# EAGLE design ds3231_breakout (EAGLE 9.3.1)
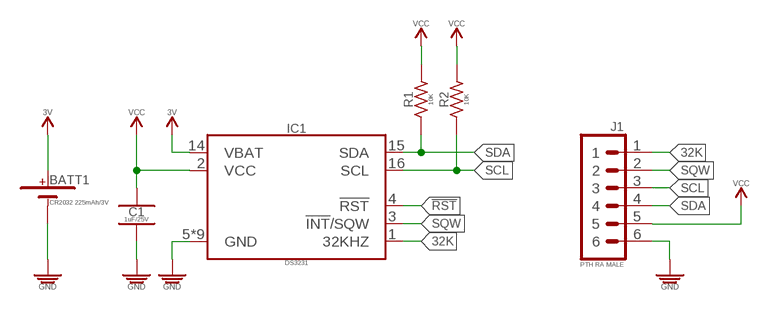
[diagram p0: schematic, sheet 1]

## Parts
BATT1  CR2032 225mAh/3V  BATTERY_COIN-CELL_PTH_3V_20MM  [BATTERY_COINCELL-20MM-PTH]
C1  1uF/25V  1UF_CER_SMD-0402_25V-10%  [CAPC1005X55_SMD-0402]
IC1  DS3231  DS3231_DS3231_RTC_CLK_I2C_SOIC-16  [SOIC127P1032X265-16]
J1  PTH RA MALE  1X06PTH_RA_MALE_2.54MM  [HDRRA6W64P254_1X6_1524X254X254B]
R1  10K  10KΩ_SMD-0402_1/16W-5%  [RESC1005X35_SMD-0402]
R2  10K  10KΩ_SMD-0402_1/16W-5%  [RESC1005X35_SMD-0402]

## Nets
3V: BATT1.+ IC1.14(VBAT)
32K: IC1.1(32KHZ) J1.1
!RST: IC1.4(!RST)
GND: BATT1.- C1.2 IC1.5(GND) IC1.6(GND) IC1.7(GND) IC1.8(GND) IC1.9(GND) IC1.10(GND) IC1.11(GND) IC1.12(GND) IC1.13(GND) J1.6
SCL: IC1.16(SCL) J1.3 R2.1
SDA: IC1.15(SDA) J1.4 R1.1
SQW: IC1.3(!INT!/SQW) J1.2
VCC: C1.1 IC1.2(VCC) J1.5 R1.2 R2.2

## Library data of the parts
BATT1 = _batteries:BATTERY_COIN-CELL; DATASHEET: https://media.digikey.com/pdf/Data%20Sheets/Panasonic%20Inustrial/CR_Series.pdf; DATASHEET_CONNECTOR: http://www.memoryprotectiondevices.com/datasheets/BS-7-datasheet.pdf; DIST: Digikey; DISTLINK: https://www.digikey.com/product-detail/en/panasonic-bsg/CR2032/P189-ND/31939; DISTLINK_CONNECTOR: https://www.digikey.com/product-detail/en/mpd-memory-protection-devices/BS-7/BS-7-ND/389447; DISTPN: P189-ND; DISTPN_CONNECTOR: BS-7-ND; DIST_CONNECTOR: Digikey; MFR: Panasonic - BSG; MFR_CONNECTOR: BS-7-ND; MPN: CR2032; MPN_CONNECTOR: BS-7
C1 = _capacitors:1UF; DATASHEET: https://product.tdk.com/info/en/catalog/datasheets/mlcc_commercial_lowprofile_en.pdf; DIST: Digikey; DISTLINK: https://www.digikey.com/products/en?keywords=445-13185-1-ND; DISTPN: 445-13185-1-ND; MFR: TDK Corporation; MPN: CGB2A1X5R1E105K033BC
IC1 = _special:DS3231; DATASHEET: https://datasheets.maximintegrated.com/en/ds/DS3231-DS3231S.pdf; DIST: Digikey; DISTLINK: https://www.digikey.com/products/en?keywords=DS3231S%23T%26RCT-ND; DISTPN: DS3231S#T&RCT-ND; MFR: Maxim Integrated; MPN: DS3231S#T&R
J1 = _connectors:1X06; DATASHEET: https://s3.amazonaws.com/catalogspreads-pdf/PAGE112-113%20.100%20MALE%20HDR.pdf; DIST: Digikey; DISTLINK: https://www.digikey.com/products/en?keywords=S1112E-06-ND; DISTPN: S1112E-06-ND; MFR: Sullins Connector Solutions; MPN: PEC06SBAN
R1 R2 = _resistors:10KΩ; DATASHEET: http://www.yageo.com/NewPortal/yageodocoutput?fileName=/pdf/R-Chip/PYu-RC_51_RoHS_P_0.pdf; DIST: Digikey; DISTLINK: https://www.digikey.com/products/en?keywords=YAG1281CT-ND; DISTPN: YAG1281CT-ND; MFR: Yageo; MPN: RC0402JR-0710KP

## Board
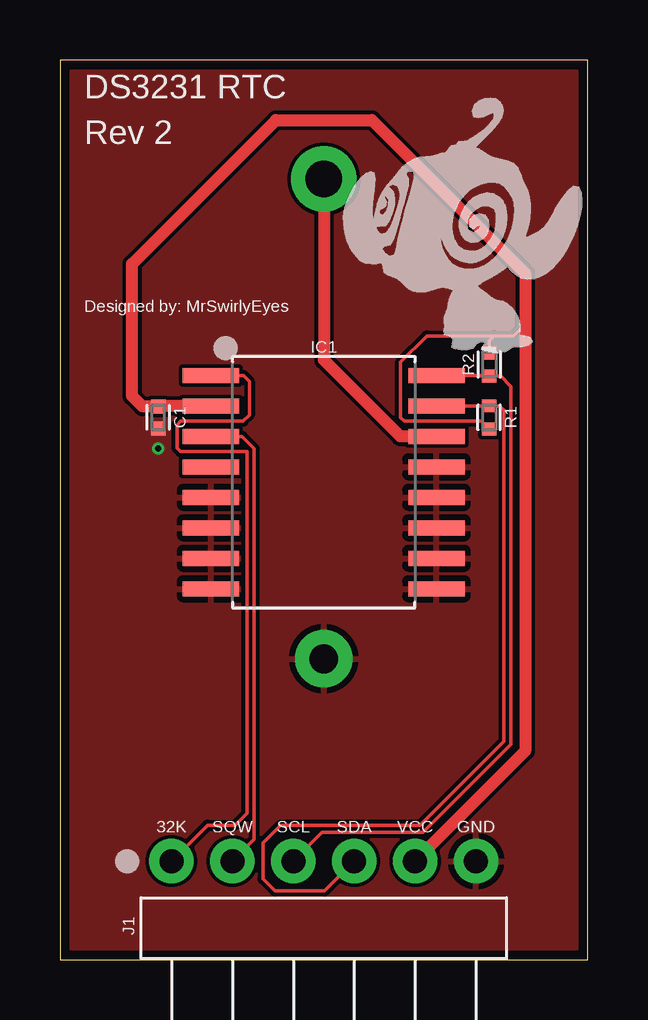
[diagram p1: board, top side]
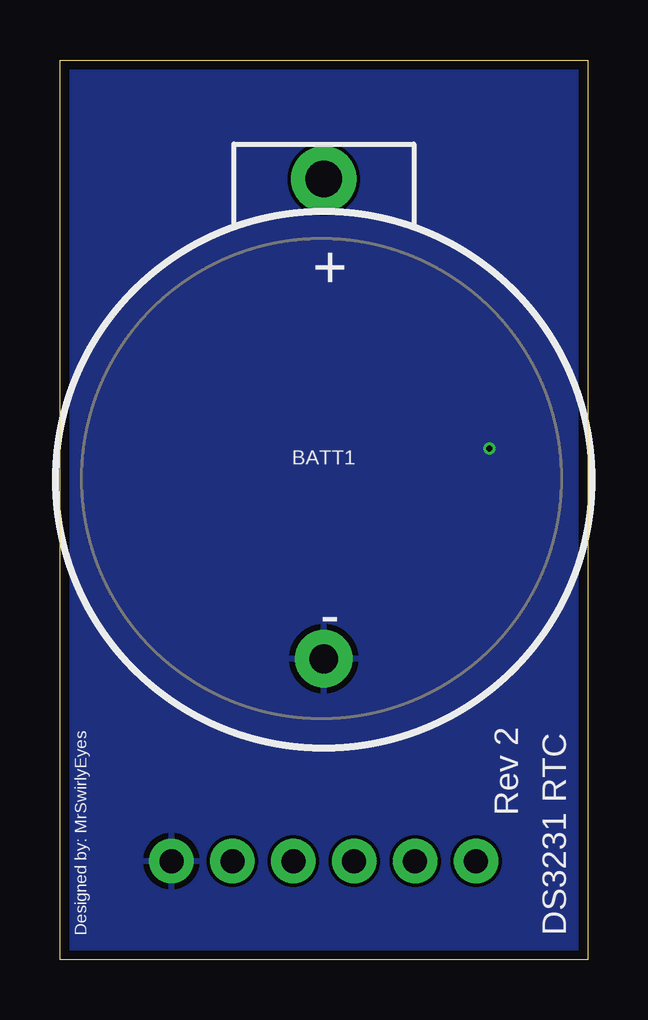
[diagram p2: board, bottom side, seen from below]

Size 22 x 37.5 mm. Coordinates in mm from the lower left corner, seen from the top.
Outline: 0,0 22,0 22,37.5 0,37.5 0,0
Copper layers (1*16): Top 0.035559375mm / dielectric 1.6mm / Bottom 0.035559375mm
Design rules "oshpark-2layer": minimum track width 6mil, minimum drill 10mil, track to track 6mil, track to pad 6mil, pad to pad 6mil, via to via 6mil, smd to smd 6mil, copper to edge 15mil, drill to drill 6mil, minimum pad ring 5mil, minimum via ring 5mil, stop-mask expansion 2.5mil, vias tented up to drill 0mil, thermal gap 10mil

### Footprints (pad centres in the part's own frame; a part is rotated, then mirrored left to right if it is on the bottom)
BATTERY_COINCELL-20MM-PTH = drill 1.525 pad 2.725: + 0,12.535 | drill 1.195 pad 2.395: - 0,-7.465
CAPC1005X55_SMD-0402 = smd 0.585 x 0.612: 1 -0.458,0; 2 0.458,0
SOIC127P1032X265-16 = smd 2.352 x 0.629: 1 -4.704,4.445; 2 -4.704,3.175; 3 -4.704,1.905; 4 -4.704,0.635; 5 -4.704,-0.635; 6 -4.704,-1.905; 7 -4.704,-3.175; 8 -4.704,-4.445; 9 4.704,-4.445; 10 4.704,-3.175; 11 4.704,-1.905; 12 4.704,-0.635; 13 4.704,0.635; 14 4.704,1.905; 15 4.704,3.175; 16 4.704,4.445
HDRRA6W64P254_1X6_1524X254X254B = drill 1 pad 1.85: 1 -6.35,0; 2 -3.81,0; 3 -1.27,0; 4 1.27,0; 5 3.81,0; 6 6.35,0
RESC1005X35_SMD-0402 = smd 0.535 x 0.6: 1 -0.482,0; 2 0.482,0

### Placement (x,y rotation side)
BATT1  11,20 0 bottom
C1  4.1,22.6 270 top
IC1  11,19.9 0 top
J1  11,4.1 0 top
R1  17.9,22.6 270 top
R2  17.9,24.8 90 top
U$1  [MRSWIRLYEYES-LOGO]  16.8,30.6 0 top

### Tracks (layer width: path | path; a pad name or v marks a point on that pad's centre or on a via)
3V
  Top 0.508: IC1.14 14.2,21.8 11,25 BATT1.+
32K
  Top 0.152: IC1.1 7.65,24.34 7.9,24.1 7.9,22.7 7.64,22.44 5.03,22.44 4.88,22.29 4.88,21.32 5.03,21.17 7.79,21.17 7.79,6.09 7.3,5.6 6.15,5.6 J1.1
GND  (via drill 0.25)
  other vias: 4.1,21.3
  pour Bottom: 0,37.5 0,0 22,0 22,37.5
  pour Top: 0,37.5 0,0 22.1,0 22,37.5
SCL
  Top 0.152: IC1.16 17.9,24.34 R2.1 18.38,24.32 18.8,23.89 18.8,8.97 15.13,5.29 10.93,5.29 J1.3
SDA
  Top 0.152: IC1.15 R1.1 18.32,23.08 18.5,22.9 18.5,9.1 15,5.6 9.2,5.6 8.46,4.86 8.46,3.36 8.97,2.86 11.03,2.86 J1.4
SQW
  Top 0.152: J1.2 8.1,5.01 8.1,21.3 7.6,21.8 IC1.3
VCC
  Top 0.152: R1.2 17.58,22.44 14.36,22.44 14.2,22.6 14.2,24.9 15.3,26 18.1,26 | 19.4,26.5 18.9,26 18.1,26 | R2.2 17.9,25.8 18.1,26
  Top 0.508: IC1.2 4.12,23.07 C1.1 3.44,23.06 3,23.5 3,29 9,35 13,35 19.4,28.6 19.4,26.5 19.4,8.69 J1.5

### Text on the board
tPlace: DS3231 RTC | Rev 2 | Designed by: MrSwirlyEyes | 32K | SQW | SCL | SDA | VCC | GND
bPlace: Rev 2 | DS3231 RTC | Designed by: MrSwirlyEyes